# EAGLE design Troopduino (EAGLE 9.0.1)
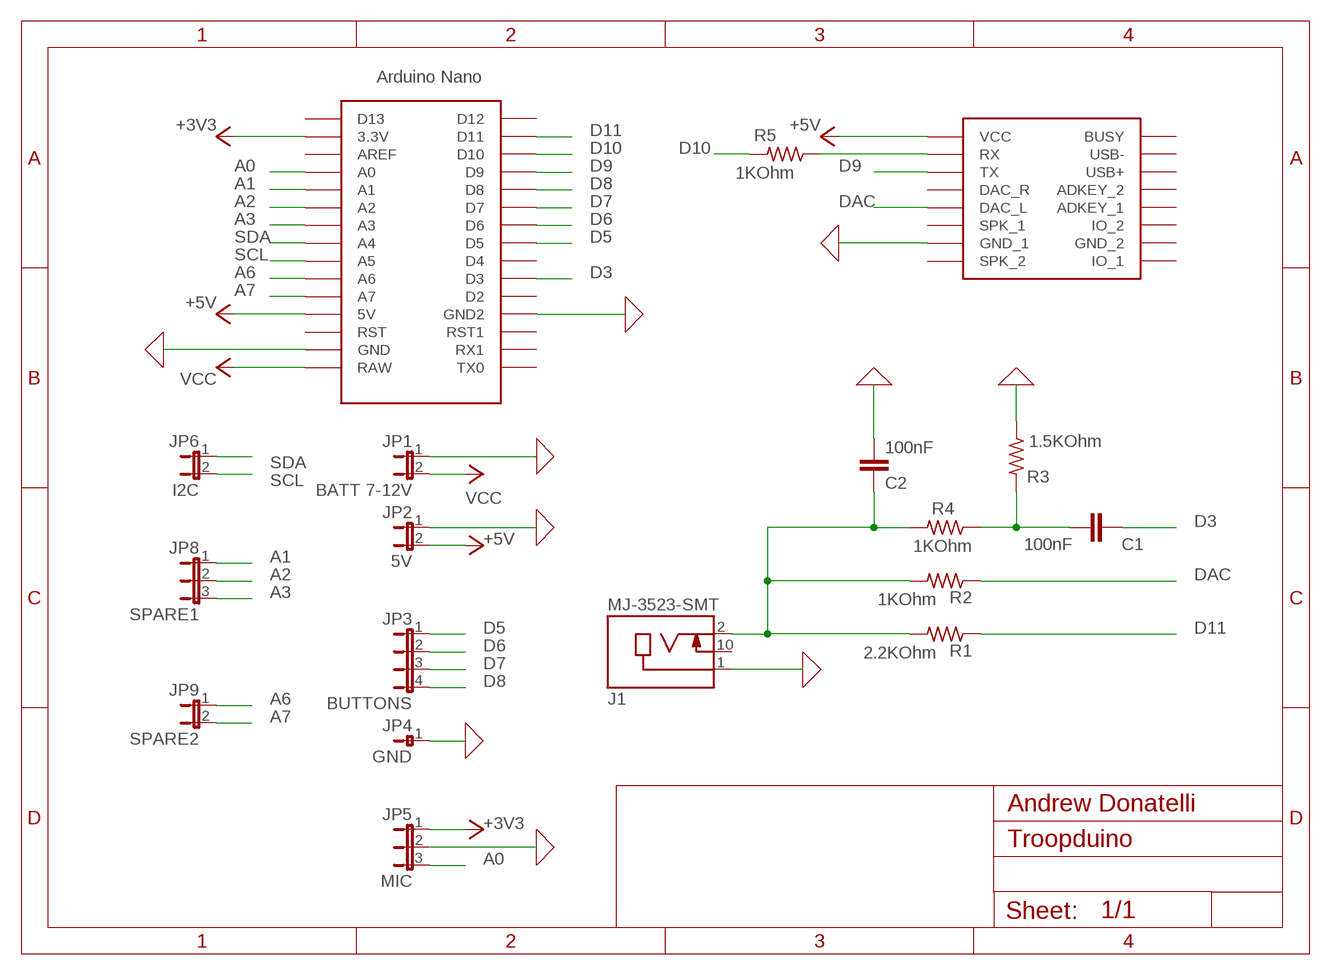
[diagram p0: schematic, sheet 1]

## Parts
C1  100nF  C-EUC0805  [C0805]
C2  100nF  C-EUC0805  [C0805]
J1  MJ-3523-SMT  [CUI_MJ-3523-SMT]
JP1  BATT 7-12V  JP1E  [JP1]
JP2  5V  JP1E  [JP1]
JP3  BUTTONS  JP4E  [JP4]
JP4  GND  JP0EJP0  [JP0]
JP5  MIC  JP2E  [JP2]
JP6  I2C  JP1E  [JP1]
JP8  SPARE1  JP2E  [JP2]
JP9  SPARE2  JP1E  [JP1]
R1  2.2KOhm  R-US_M0805  [M0805]
R2  1KOhm  R-US_M0805  [M0805]
R3  1.5KOhm  R-US_M0805  [M0805]
R4  1KOhm  R-US_M0805  [M0805]
R5  1KOhm  R-US_M0805  [M0805]
U$1  DFPLAYER  [DFPLAYER]
U$2  NANO  [NANO]

## Nets
0: C2.1 J1.1 JP1.1 JP2.1 JP4.1 JP5.2 R3.1 U$1.GND_1 U$2.GND U$2.GND1(GND2) ; supply symbol labelled GND
+3V3: JP5.1 U$2.3.3V
+5V: JP2.2 U$1.VCC U$2.5V
A0: JP5.3 U$2.A0
A1: JP8.1 U$2.A1
A2: JP8.2 U$2.A2
A3: JP8.3 U$2.A3
A6: JP9.1 U$2.A6
A7: JP9.2 U$2.A7
D3: C1.1 U$2.D3
D5: JP3.1 U$2.D5
D6: JP3.2 U$2.D6
D7: JP3.3 U$2.D7
D8: JP3.4 U$2.D8
D9: U$1.TX U$2.D9
D10: R5.2 U$2.D10
D11: R1.1 U$2.D11
DAC: R2.1 U$1.DAC_L
N$1: R5.1 U$1.RX
N$4: C1.2 R3.2 R4.1
N$7: C2.2 J1.2 R1.2 R2.2 R4.2
SCL: JP6.2 U$2.A5
SDA: JP6.1 U$2.A4
VCC: JP1.2 U$2.RAW
Unconnected: J1.10 U$1.ADKEY1(ADKEY_1) U$1.ADKEY2(ADKEY_2) U$1.BUSY U$1.DAC_R U$1.GND_2 U$1.IO1(IO_1) U$1.IO2(IO_2) U$1.SPK1(SPK_1) U$1.SPK2(SPK_2) U$1.USB+ U$1.USB- U$2.AREF U$2.D2 U$2.D4 U$2.D12 U$2.D13 U$2.RST U$2.RST1 U$2.RX1 U$2.TX0

## Notes on the sheet
- Andrew Donatelli

## Library data of the parts
C1 C2 = resistor:C-EU: CAPACITOR, European symbol
J1 = MJ-3523-SMT:MJ-3523-SMT: 3.5 mm, Mono, Right Angle, Surface Mount (SMT), Audio Jack Connector; MANUFACTURER: CUI INC; PART_REV: D; STANDARD: MANUFACTURER RECOMMENDATIONS
JP1 JP2 JP6 JP9 = jumper-ad:JP1E: JUMPER
JP3 = jumper-ad:JP4E: JUMPER
JP4 = jumper-ad:JP0E: JUMPER
JP5 JP8 = jumper-ad:JP2E: JUMPER
R1-R5 = resistor:R-US_: RESISTOR, American symbol
U$1 = DFPlayer_v1:DFPLAYER
U$2 = Arduino-clone:NANO: Arduino Nano

## Board
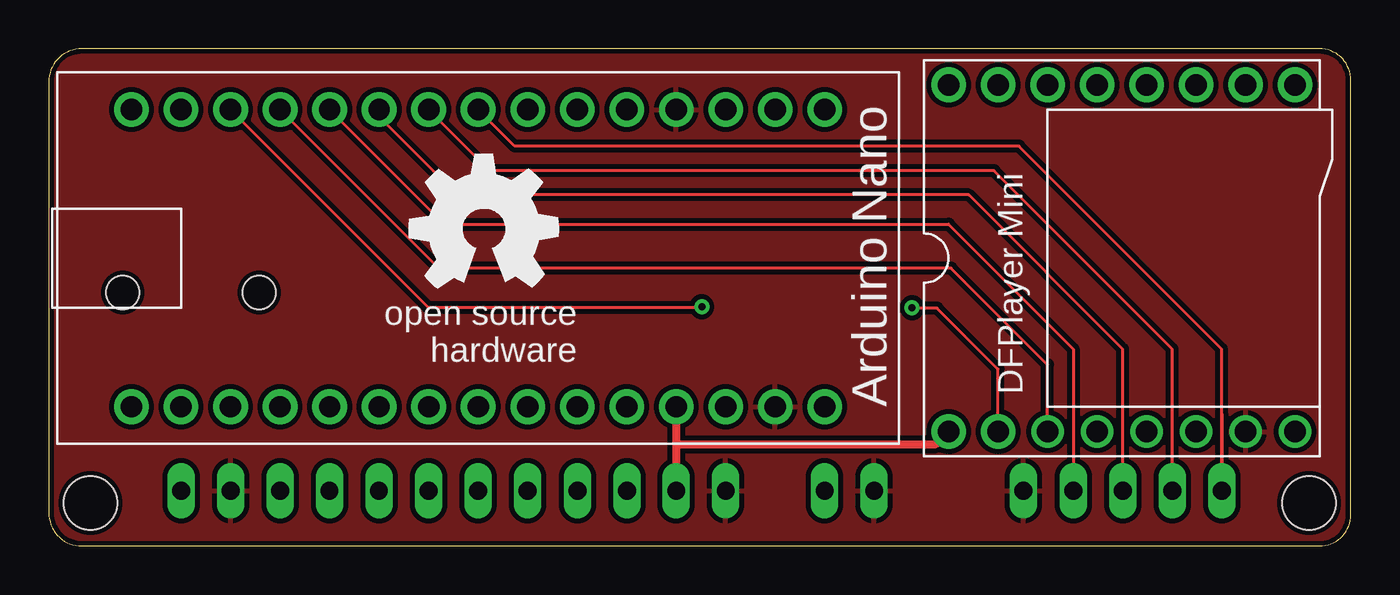
[diagram p1: board, top side]
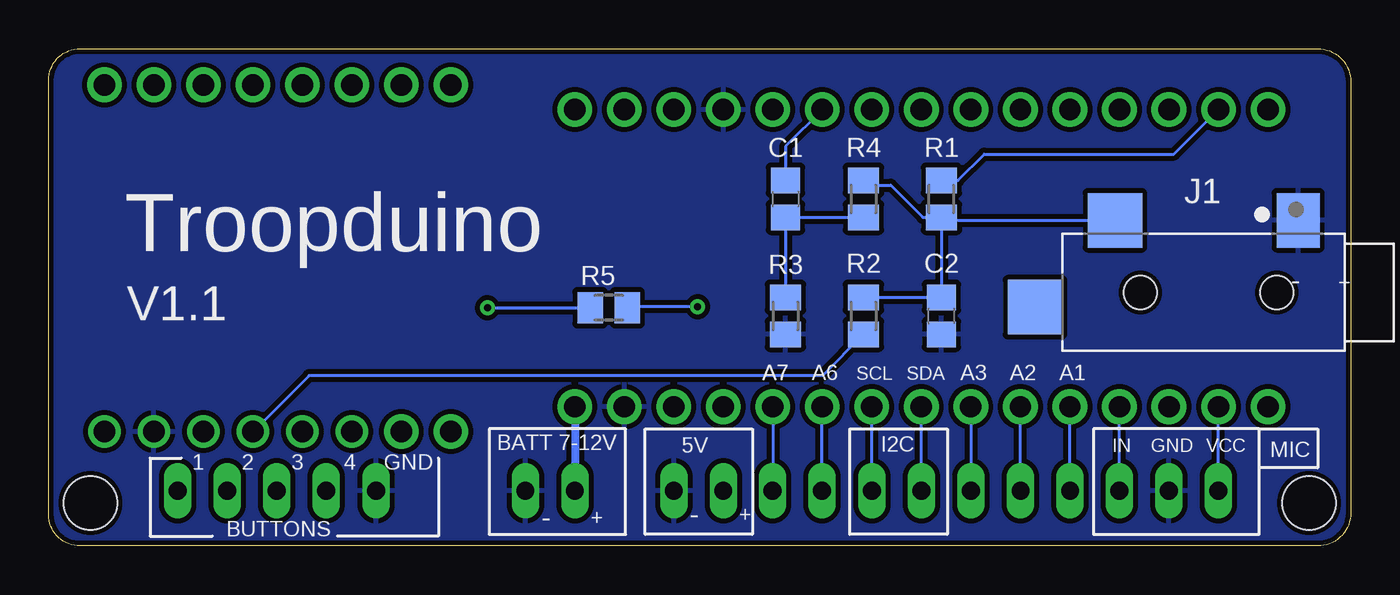
[diagram p2: board, bottom side, seen from below]

Size 66.8 x 25.5 mm. Coordinates in mm from the lower left corner, seen from the top.
Outline: 1.7,0 65.2,0 arc90 66.8,1.6 66.8,23.9 arc90 65.2,25.5 1.7,25.5 arc90 0,23.8 0,1.7 arc90 1.7,0
Copper layers (1*16): Top 0.035mm / dielectric 1.5mm / Bottom 0.035mm
Design rules "default *": minimum track width 6mil, minimum drill 12mil, track to track 6mil, track to pad 6mil, pad to pad 6mil, via to via 6mil, smd to smd 0mil, copper to edge 10mil, drill to drill 10mil, minimum pad ring 10mil, minimum via ring 8mil, stop-mask expansion 4mil, vias tented up to drill 0mil, thermal gap 10mil
Holes 2.75 mm at 64.66,2.2 2.14,2.2

### Footprints (pad centres in the part's own frame; a part is rotated, then mirrored left to right if it is on the bottom)
C0805 = smd 1.3 x 1.5: 1 -0.95,0; 2 0.95,0
CUI_MJ-3523-SMT = smd 2.2 x 2.8: 1 4.85,3.7 | smd 2.8 x 2.8: 2 -4.55,3.7; 10 -8.65,-0.75 | hole 1.7: 3.75,0; -3.25,0
JP1 = drill 0.914 long: 1 0,-1.27; 2 0,1.27
JP4 = drill 0.914 long: 1 -3.81,0; 2 -1.27,0; 3 1.27,0; 4 3.81,0
JP0 = drill 0.914 long: 1 0,-1.27
JP2 = drill 0.914 long: 1 -2.54,0; 2 0,0; 3 2.54,0
M0805 = smd 1.3 x 1.6: 1 -0.95,0; 2 0.95,0
DFPLAYER = drill 1.1 pad 1.778: ADKEY1 8.89,-1.27; ADKEY2 8.89,1.27; BUSY 8.89,8.89; GND_2 8.89,-6.35; IO1 8.89,-8.89; IO2 8.89,-3.81; RX -8.89,6.35; USB+ 8.89,3.81; USB- 8.89,6.35; VCC -8.89,8.89 | drill 1.1 pad 1.676: DAC_L -8.89,-1.27; DAC_R -8.89,1.27; GND_1 -8.89,-6.35; SPK1 -8.89,-3.81; SPK2 -8.89,-8.89; TX -8.89,3.81
NANO = drill 1.1 pad 1.778: 3.3V -10.16,24.13; 5V -10.16,-1.27; A0 -10.16,19.05; A1 -10.16,16.51; A2 -10.16,13.97; A3 -10.16,11.43; A4 -10.16,8.89; A5 -10.16,6.35; A6 -10.16,3.81; A7 -10.16,1.27; AREF -10.16,21.59; D2 5.08,1.27; D3 5.08,3.81; D4 5.08,6.35; D5 5.08,8.89; D6 5.08,11.43; D7 5.08,13.97; D8 5.08,16.51; D9 5.08,19.05; D10 5.08,21.59; D11 5.08,24.13; D12 5.08,26.67; D13 -10.16,26.67; GND -10.16,-6.35; GND1 5.08,-1.27; RAW -10.16,-8.89; RST -10.16,-3.81; RST1 5.08,-3.81; RX1 5.08,-6.35; TX0 5.08,-8.89

### Placement (x,y rotation side)
C1  29,17.8 270 bottom
C2  21,11.8 90 bottom
J1  7.55,13 0 bottom
JP1  41.08,2.83 270 bottom
JP2  33.46,2.83 270 bottom
JP3  56.37,2.83 0 bottom
JP4  48.73,2.83 270 bottom
JP5  9.33,2.83 180 bottom
JP6  23.29,2.83 90 bottom
JP8  16.94,2.83 180 bottom
JP9  28.39,2.83 90 bottom
R1  21,17.8 270 bottom
R2  25,11.8 90 bottom
R3  29,11.8 90 bottom
R4  25,17.8 90 bottom
R5  38.07,12.22 0 bottom
U$1  55.05,14.76 90 top
U$2  30.92,17.3 90 top
U$3  [OSHW_8MM]  22.3,16.25 0 top

### Tracks (layer width: path | path; a pad name or v marks a point on that pad's centre or on a via)
0
  pour Top (isolate 0.254): 66.8,25.5 66.8,0 0,0 0,25.5
  pour Bottom (isolate 0.254): 66.8,25.5 0,25.5 0,0 66.8,0
+3V3
  Bottom 0.152: JP5.1 U$2.3.3V
+5V
  Top 0.406: U$2.5V 32.19,5.22 | 32.19,5.22 JP2.2 | 32.19,5.22 45.51,5.22 U$1.VCC
A0
  Bottom 0.152: JP5.3 U$2.A0
A1
  Bottom 0.152: JP8.1 U$2.A1
A2
  Bottom 0.152: JP8.2 U$2.A2
A3
  Bottom 0.152: U$2.A3 JP8.3
A6
  Bottom 0.152: JP9.1 27.12,7.12 U$2.A6
A7
  Bottom 0.152: U$2.A7 29.65,2.84 JP9.2
D3
  Bottom 0.152: U$2.D3 29,20.49 C1.1
D5
  Top 0.152: 60.18,6.77 JP3.1 60.18,10.1 49.78,20.51 23.9,20.51 U$2.D5
D6
  Top 0.152: U$2.D6 22.62,19.25 48.49,19.25 57.64,10.1 JP3.2
D7
  Top 0.152: U$2.D7 16.95,22 20.95,18 47.2,18 55.1,10.1 JP3.3
D8
  Top 0.152: JP3.4 52.56,10.1 46.16,16.5 20.29,16.5 U$2.D8
D9
  Top 0.152: U$2.D9 20,14.25 46.29,14.25 51.24,9.3 U$1.TX
D10  (via drill 0.35)
  Top 0.152: U$2.D10 19.46,12.25 33.49,12.25 v33.51,12.27
  Bottom 0.152: v33.51,12.27 37.07,12.27 R5.2
D11
  Bottom 0.152: R1.1 20.15,18.75 18.8,20.1 9.07,20.1 U$2.D11
DAC
  Bottom 0.152: U$1.DAC_L 53.45,8.74 | 53.45,8.74 53.45,8.75 | R2.1 27.11,8.74 53.45,8.74
N$1  (via drill 0.35)
  Top 0.152: U$1.RX 48.7,9.07 45.57,12.2 44.31,12.2 v44.29,12.22
  Bottom 0.152: v44.29,12.22 R5.1
N$4
  Bottom 0.152: R3.2 C1.2 R4.1
N$7
  Bottom 0.152: R1.2 20.15,16.7 J1.2 | R1.2 21,12.9 | 21,12.9 C2.2 | R2.2 21.15,12.75 21,12.9 | R4.2 24.75,18.5 23.6,18.5 21.95,16.85 R1.2
SCL
  Bottom 0.152: JP6.2 U$2.A5
SDA
  Bottom 0.152: JP6.1 U$2.A4
VCC
  Bottom 0.406: U$2.RAW JP1.2

### Text on the board
tNames: Arduino Nano
bNames: Troopduino | - | + | V1.1 | A1 | A2 | A3 | SDA | SCL | A6 | A7 | A7 | VCC | GND | IN | 4 | 3 | 2 | 1 | + | - | + | -